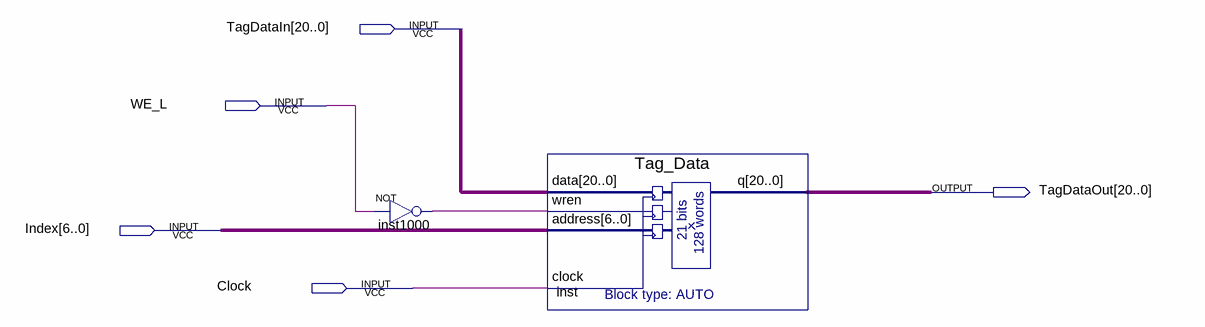
[diagram p0: schematic sheet]
// Quartus schematic TagMemory.bdf as structural Verilog: 2 symbols, 5 pins
module TagMemory (
  input  [20:0] TagDataIn,
  input  WE_L,
  input  [6:0] Index,
  input  Clock,
  output [20:0] TagDataOut
);

  wire inst1000_out;

  not inst1000 (inst1000_out, WE_L);
  Tag_Data inst (.data(TagDataIn), .wren(inst1000_out), .address(Index), .clock(Clock), .q(TagDataOut));
endmodule
